# Altium schematic sheet MCU.SchDoc
size A; SheetNumber: 3; SheetTotal: 16
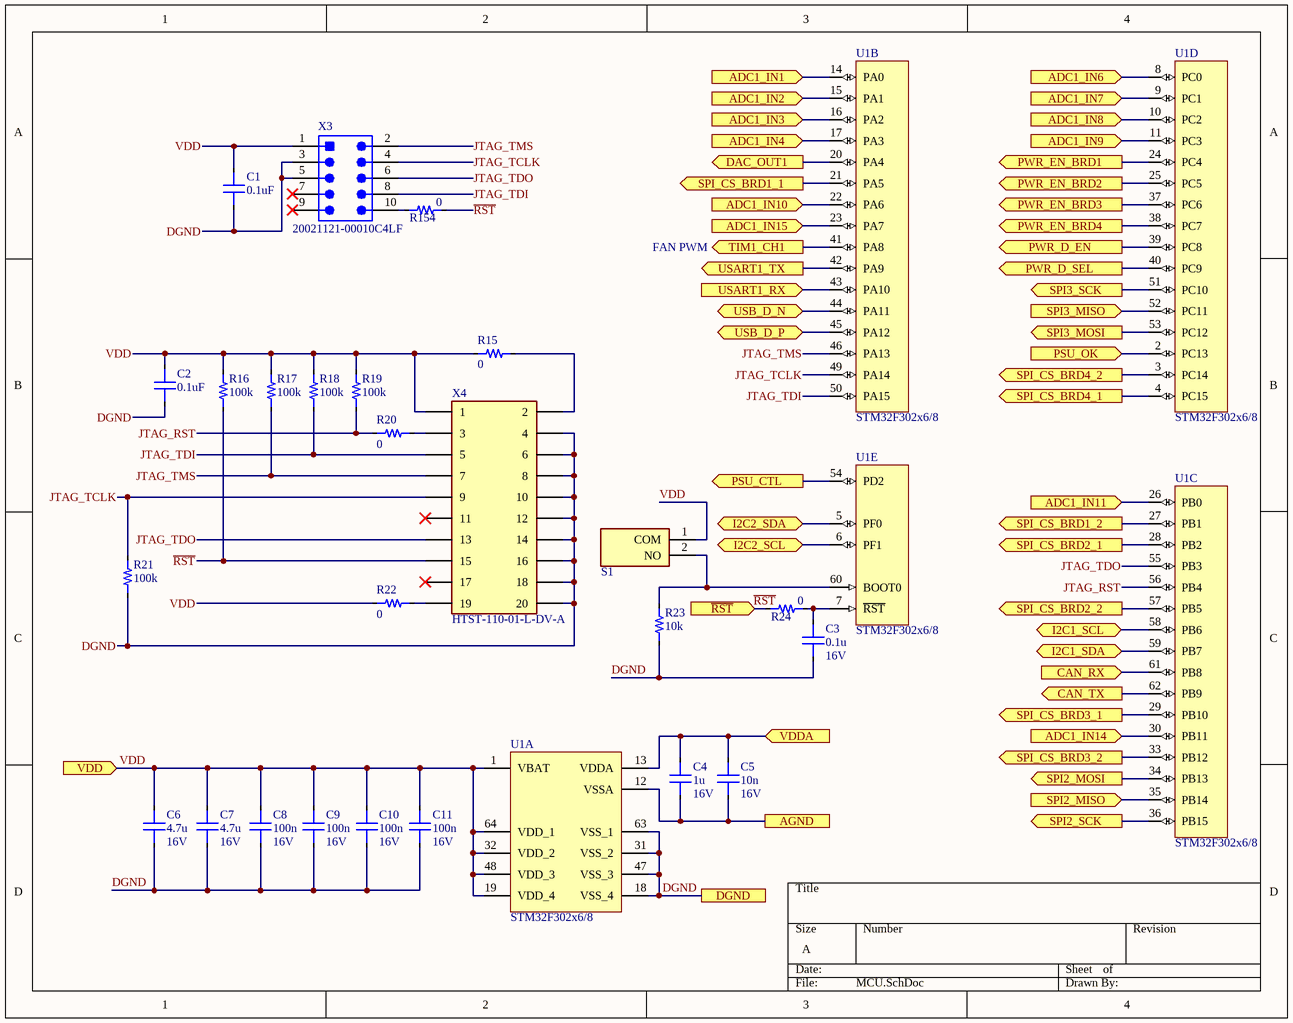
[diagram p0: MCU.SchDoc]

## Parts
C1  value 0.1uF  [0603_CAP]  (hidden comment: Capacitor)
C2  value 0.1uF  [0603_CAP]  (hidden comment: Capacitor)
C3  value 0.1u  Voltage: 16V  [0603_CAP]  (hidden comment: Capacitor)
C4  value 1u  Voltage: 16V  [0603_CAP]  (hidden comment: Capacitor)
C5  value 10n  Voltage: 16V  [0603_CAP]  (hidden comment: Capacitor)
C6  value 4.7u  Voltage: 16V  [0805_CAP]  (hidden comment: Capacitor)
C7  value 4.7u  Voltage: 16V  [0805_CAP]  (hidden comment: Capacitor)
C8  value 100n  Voltage: 16V  [0603_CAP]  (hidden comment: Capacitor)
C9  value 100n  Voltage: 16V  [0603_CAP]  (hidden comment: Capacitor)
C10  value 100n  Voltage: 16V  [0603_CAP]  (hidden comment: Capacitor)
C11  value 100n  Voltage: 16V  [0603_CAP]  (hidden comment: Capacitor)
R15  value 0  [0603_RES]  (hidden comment: Resistor)
R16  value 100k  [0603_RES]  (hidden comment: Resistor)
R17  value 100k  [0603_RES]  (hidden comment: Resistor)
R18  value 100k  [0603_RES]  (hidden comment: Resistor)
R19  value 100k  [0603_RES]  (hidden comment: Resistor)
R20  value 0  [0603_RES]  (hidden comment: Resistor)
R21  value 100k  [0603_RES]  (hidden comment: Resistor)
R22  value 0  [0603_RES]  (hidden comment: Resistor)
R23  value 10k  [0603_RES]  (hidden comment: Resistor)
R24  value 0  [0603_RES]  (hidden comment: Resistor)
R154  value 0  [0603_RES]  (hidden comment: Resistor)
S1  DS04-254-2-01BK-SMT-TR  [DS04254201BKSMTTR]  (value not drawn)
U1  STM32F302x6/8  [LQFP 10mm x 10mm]  (parts A,B,C,D,E of 5)
X3  20021121-00010C4LF  [HDR2X5_SMT]
X4  HTST-110-01-L-DV-A  [HTSS-110-01-L-DV]

## Ports
ADC1_IN1 (in), ADC1_IN2 (in), ADC1_IN3 (in), ADC1_IN4 (in), ADC1_IN6 (in), ADC1_IN7 (in), ADC1_IN8 (in), ADC1_IN9 (in), ADC1_IN10 (in), ADC1_IN11 (in), ADC1_IN14 (in), ADC1_IN15 (in), AGND, CAN_RX (in), CAN_TX (out), DAC_OUT1 (out), DGND, I2C1_SCL (bidir), I2C1_SDA (bidir), I2C2_SCL (bidir), I2C2_SDA (bidir), PSU_CTL (out), PSU_OK (in), PWR_D_EN (out), PWR_D_SEL (out), PWR_EN_BRD1 (out), PWR_EN_BRD2 (out), PWR_EN_BRD3 (out), PWR_EN_BRD4 (out), SPI2_MISO (in), SPI2_MOSI (out), SPI2_SCK (out), SPI3_MISO (in), SPI3_MOSI (out), SPI3_SCK (out), SPI_CS_BRD1_1 (out), SPI_CS_BRD1_2 (out), SPI_CS_BRD2_1 (out), SPI_CS_BRD2_2 (out), SPI_CS_BRD3_1 (out), SPI_CS_BRD3_2 (out), SPI_CS_BRD4_1 (out), SPI_CS_BRD4_2 (out), TIM1_CH1 (out), USART1_RX (in), USART1_TX (out), USB_D_N (bidir), USB_D_P (bidir), VDD (in), VDDA (in), ~{RST} (in)

## Nets
ADC1_IN1: U1.14(PA0) ; port ADC1_IN1
ADC1_IN2: U1.15(PA1) ; port ADC1_IN2
ADC1_IN3: U1.16(PA2) ; port ADC1_IN3
ADC1_IN4: U1.17(PA3) ; port ADC1_IN4
ADC1_IN6: U1.8(PC0) ; port ADC1_IN6
ADC1_IN7: U1.9(PC1) ; port ADC1_IN7
ADC1_IN8: U1.10(PC2) ; port ADC1_IN8
ADC1_IN9: U1.11(PC3) ; port ADC1_IN9
ADC1_IN10: U1.22(PA6) ; port ADC1_IN10
ADC1_IN11: U1.26(PB0) ; port ADC1_IN11
ADC1_IN14: U1.30(PB11) ; port ADC1_IN14
ADC1_IN15: U1.23(PA7) ; port ADC1_IN15
AGND: C4.1 C5.1 U1.12(VSSA) ; port AGND
CAN_RX: U1.61(PB8) ; port CAN_RX
CAN_TX: U1.62(PB9) ; port CAN_TX
DAC_OUT1: U1.20(PA4) ; port DAC_OUT1
DGND: C1.1 C2.1 C3.1 C6.1 C7.1 C8.1 C9.1 C10.1 C11.1 R21.1 R23.1 U1.18(VSS_4) U1.31(VSS_2) U1.47(VSS_3) U1.63(VSS_1) X3.3 X3.5 X4.04(4) X4.06(6) X4.08(8) X4.10 X4.12 X4.14 X4.16 X4.18 X4.20 ; port DGND
I2C1_SCL: U1.58(PB6) ; port I2C1_SCL
I2C1_SDA: U1.59(PB7) ; port I2C1_SDA
I2C2_SCL: U1.6(PF1) ; port I2C2_SCL
I2C2_SDA: U1.5(PF0) ; port I2C2_SDA
JTAG_RST: R19.1 R20.1 U1.56(PB4)
JTAG_TCLK: R21.2 U1.49(PA14) X3.4 X4.09(9)
JTAG_TDI: R18.1 U1.50(PA15) X3.8 X4.05(5)
JTAG_TDO: U1.55(PB3) X3.6 X4.13
JTAG_TMS: R17.1 U1.46(PA13) X3.2 X4.07(7)
PSU_CTL: U1.54(PD2) ; port PSU_CTL
PSU_OK: U1.2(PC13) ; port PSU_OK
PWR_D_EN: U1.39(PC8) ; port PWR_D_EN
PWR_D_SEL: U1.40(PC9) ; port PWR_D_SEL
PWR_EN_BRD1: U1.24(PC4) ; port PWR_EN_BRD1
PWR_EN_BRD2: U1.25(PC5) ; port PWR_EN_BRD2
PWR_EN_BRD3: U1.37(PC6) ; port PWR_EN_BRD3
PWR_EN_BRD4: U1.38(PC7) ; port PWR_EN_BRD4
~{RST}: R16.1 R24.1 R154.2 X4.15 ; port ~{RST}
SPI2_MISO: U1.35(PB14) ; port SPI2_MISO
SPI2_MOSI: U1.34(PB13) ; port SPI2_MOSI
SPI2_SCK: U1.36(PB15) ; port SPI2_SCK
SPI3_MISO: U1.52(PC11) ; port SPI3_MISO
SPI3_MOSI: U1.53(PC12) ; port SPI3_MOSI
SPI3_SCK: U1.51(PC10) ; port SPI3_SCK
SPI_CS_BRD1_1: U1.21(PA5) ; port SPI_CS_BRD1_1
SPI_CS_BRD1_2: U1.27(PB1) ; port SPI_CS_BRD1_2
SPI_CS_BRD2_1: U1.28(PB2) ; port SPI_CS_BRD2_1
SPI_CS_BRD2_2: U1.57(PB5) ; port SPI_CS_BRD2_2
SPI_CS_BRD3_1: U1.29(PB10) ; port SPI_CS_BRD3_1
SPI_CS_BRD3_2: U1.33(PB12) ; port SPI_CS_BRD3_2
SPI_CS_BRD4_1: U1.4(PC15) ; port SPI_CS_BRD4_1
SPI_CS_BRD4_2: U1.3(PC14) ; port SPI_CS_BRD4_2
TIM1_CH1: U1.41(PA8) ; port TIM1_CH1
USART1_RX: U1.43(PA10) ; port USART1_RX
USART1_TX: U1.42(PA9) ; port USART1_TX
USB_D_N: U1.44(PA11) ; port USB_D_N
USB_D_P: U1.45(PA12) ; port USB_D_P
VDD: C1.2 C2.2 C6.2 C7.2 C8.2 C9.2 C10.2 C11.2 R15.1 R16.2 R17.2 R18.2 R19.2 R22.1 S1.1(COM) U1.1(VBAT) U1.19(VDD_4) U1.32(VDD_2) U1.48(VDD_3) U1.64(VDD_1) X3.1 X4.01(1) ; port VDD
VDDA: C4.2 C5.2 U1.13(VDDA) ; port VDDA
NetC3_2: C3.2 R24.2 U1.7(~{RST})
NetR15_2: R15.2 X4.02(2)
NetR20_2: R20.2 X4.03(3)
NetR22_2: R22.2 X4.19
NetR23_2: R23.2 S1.2(NO) U1.60(BOOT0)
NetR154_1: R154.1 X3.10

Not connected (* = marked no-connect by the designer): X3 7* 9*; X4 11* 17*

## Notes on the sheet
- FAN PWM

## Library data of the parts
S1 = DS04-254-2-01BK-SMT-TR: DIP Switches / SIP Switches DIP Switch, SPST, 2.54 pitch, flat actuator, SMT, Tape and reel, 1 position, Black; Manufacturer_Name: CUI Devices; Datasheet Link: https://www.cuidevices.com/product/resource/supplyframepdf/ds04-254-smt.pdf; Height: 4.3mm; Manufacturer_Part_Number: DS04-254-2-01BK-SMT-TR; Mouser Part Number: 490-DS04254201BK-STR; Mouser Price/Stock: https://www.mouser.co.uk/ProductDetail/CUI-Devices/DS04-254-2-01BK-SMT-TR?qs=wnTfsH77Xs4xXRFXKF0ssg%3D%3D; Arrow Part Number: DS04-254-2-01BK-SMT-TR; Arrow Price/Stock: https://www.arrow.com/en/products/ds04-254-2-01bk-smt-tr/cui-devices?region=nac
U1 = STM32F302x6/8: Vcc: 3V3; Package: LQFP64; ComponentLink1Description: ST; ComponentLink1URL: https://www.st.com/en/microcontrollers-microprocessors/stm32f302r8.html
X3 = 20021121-00010C4LF: Header, 10-Leads, Body 3.43x6.35mm, Pitch 1.27mm; Circuits: 10; Name: 20021121-00010C4LF; ComponentLink1Description: Digikey; ComponentLink1URL: https://www.digikey.com/product-detail/en/amphenol-icc-fci/20021121-00010C4LF/609-3695-1-ND/2209147
X4 = HTST-110-01-L-DV-A: Connector Header Surface Mount 20 position 0.100" (2.54mm); MP: SSM-110-F-DV-A; MF: Samtec; Package: None; Price: None; Availability: Unavailable; Value: *; ComponentLink1Description: Samtec Site; ComponentLink1URL: https://www.samtec.com/products/htst-110-01-l-dv-a; ComponentLink2Description: Digikey; ComponentLink2URL: https://www.digikey.com/en/products/detail/samtec-inc/HTST-110-01-L-DV-A/2664196
C1-C11 = Capacitor: Dielectric: *; Percent Tolerance: *; ESR: *
R15-R24 R154 = Resistor: Tolerance: *